# Altium schematic sheet TCAN1146_PINOUT.SchDoc
size B; SheetNumber: 2; SheetTotal: 5
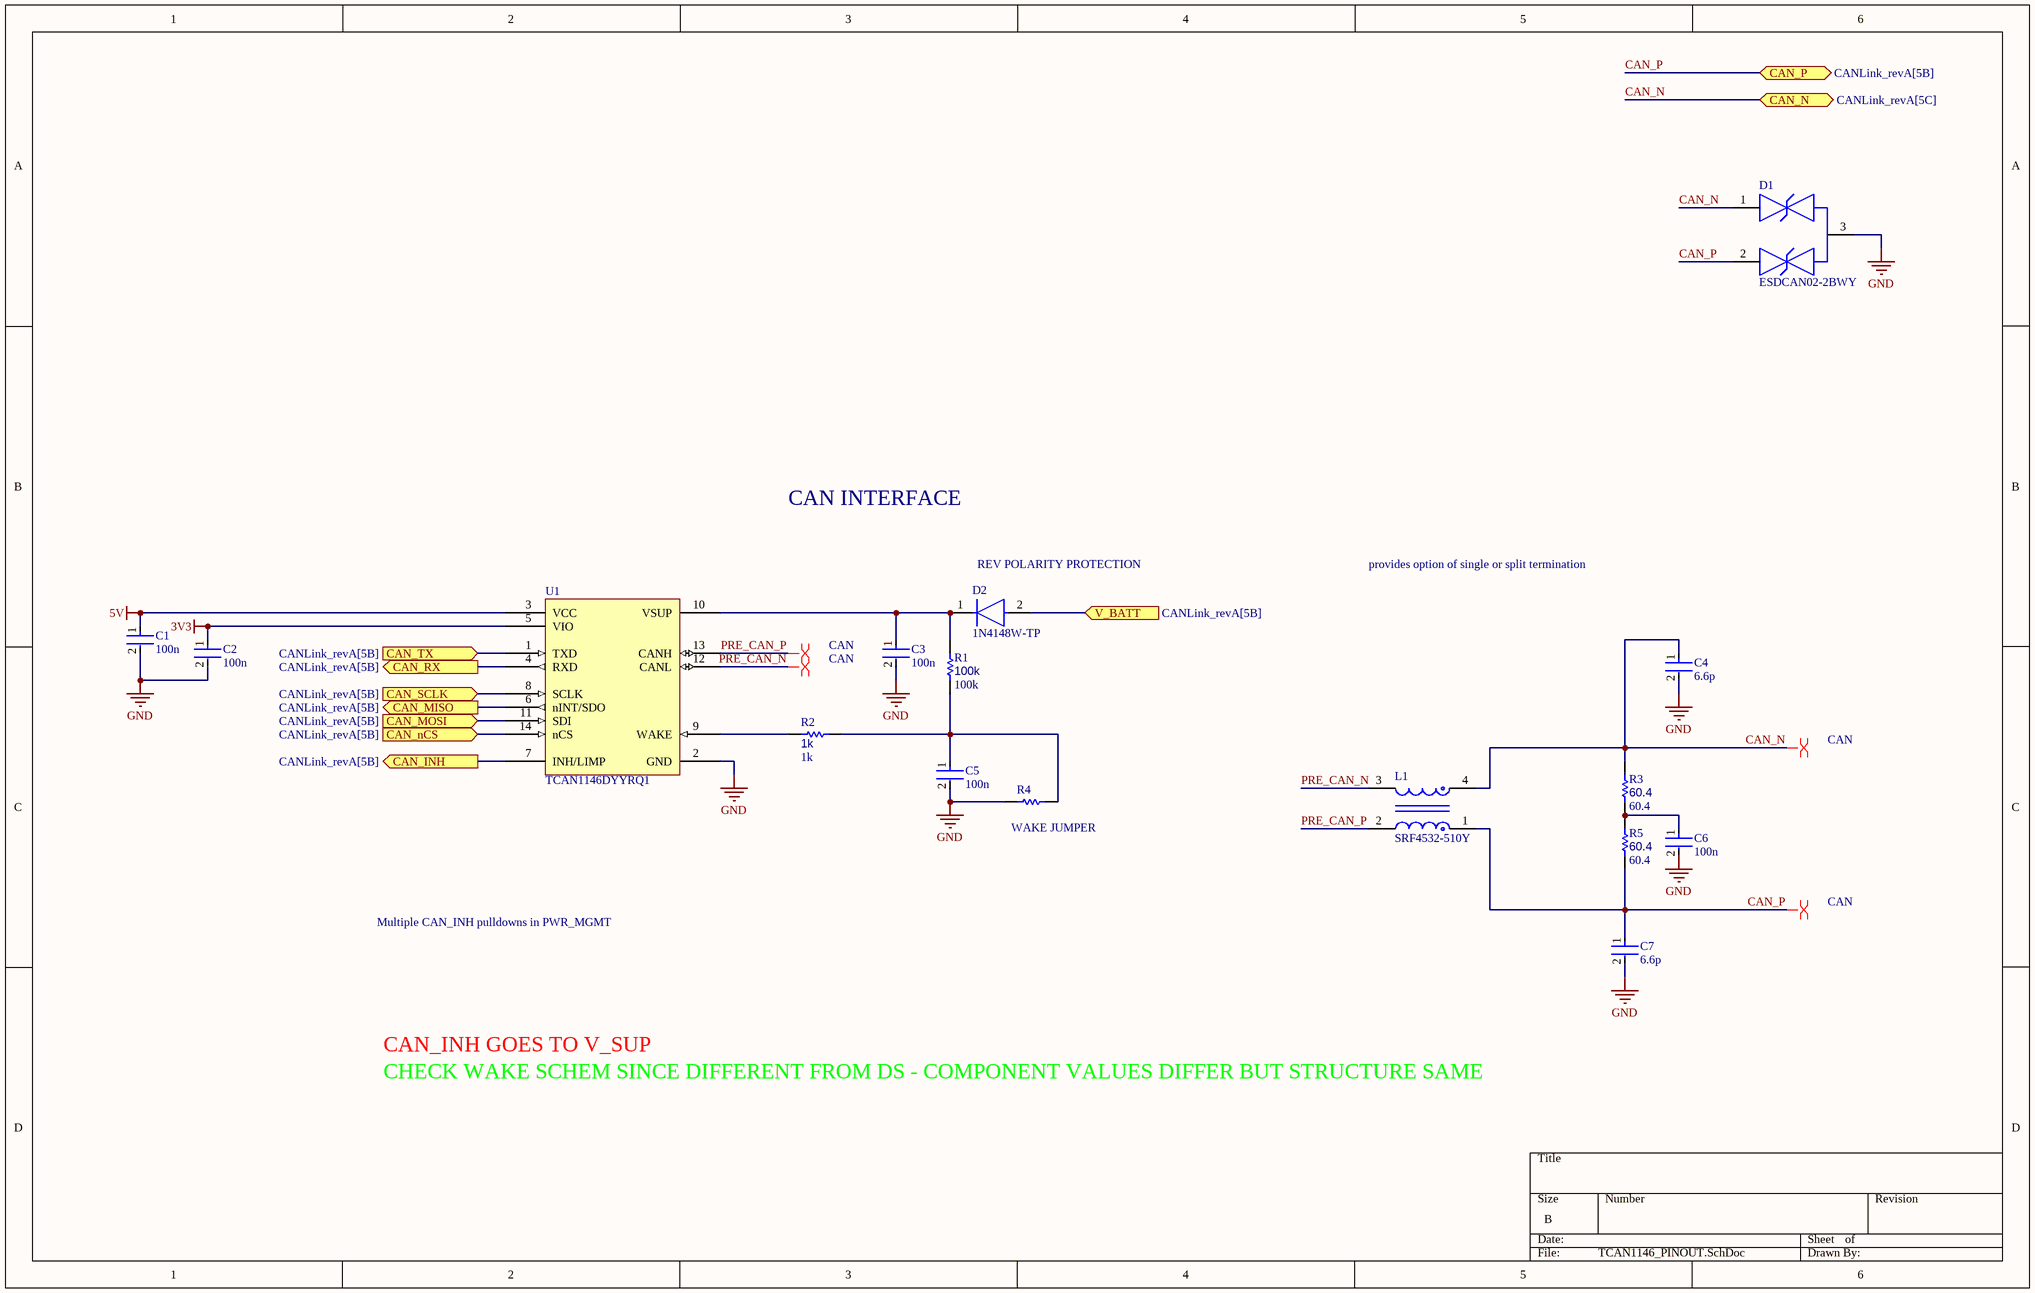
[diagram p0: TCAN1146_PINOUT.SchDoc]

## Parts
C1  100n  [FP-0402-L_1_0_0_05-W_0_5-IPC_A]
C2  100n  [FP-0402-L_1_0_0_05-W_0_5-IPC_A]
C3  100n  [FP-0402-L_1_0_0_05-W_0_5-IPC_A]
C4  6.6p  [FP-0402-L_1_0_0_05-W_0_5-IPC_A]
C5  100n  [FP-0402-L_1_0_0_05-W_0_5-IPC_A]
C6  100n  [FP-0402-L_1_0_0_05-W_0_5-IPC_A]
C7  6.6p  [FP-0402-L_1_0_0_05-W_0_5-IPC_A]
D1  ESDCAN02-2BWY  [FP-SOT323-3L-MFG]
D2  1N4148W-TP  [FP-SOD-123-IPC_A]
L1  SRF4532-510Y  [FP-SRF4532-MFG]
R1  100k  [R0603B]
R2  1k  [R0603B]
R3  60.4  [R0603B]
R4  0402 JUMPER  [RESC1005X40X25ML05T05]  (value not drawn)
R5  60.4  [R0603B]
U1  TCAN1146DYYRQ1  [TCAN1146DYYRQ1-Footprint-1]

## Ports
CAN_INH (out, see CANLink_revA[5B]), CAN_MISO (out, see CANLink_revA[5B]), CAN_MOSI (in, see CANLink_revA[5B]), CAN_N (bidir, see CANLink_revA[5C]), CAN_nCS (in, see CANLink_revA[5B]), CAN_P (bidir, see CANLink_revA[5B]), CAN_RX (out, see CANLink_revA[5B]), CAN_SCLK (in, see CANLink_revA[5B]), CAN_TX (in, see CANLink_revA[5B]), V_BATT (in, see CANLink_revA[5B])

## Nets
3V3: C2.1 U1.5(VIO)
5V: C1.1 U1.3(VCC)
GND: C1.2 C2.2 C3.2 C4.2 C5.2 C6.2 C7.2 D1.3 R4.1 U1.2(GND)
CAN_INH: U1.7(INH/LIMP) ; port CAN_INH
CAN_MISO: U1.6(nINT/SDO) ; port CAN_MISO
CAN_MOSI: U1.11(SDI) ; port CAN_MOSI
CAN_N: C4.1 D1.1 L1.4 R3.1 ; port CAN_N
CAN_nCS: U1.14(nCS) ; port CAN_nCS
CAN_P: C7.1 D1.2 L1.1 R5.2 ; port CAN_P
CAN_RX: U1.4(RXD) ; port CAN_RX
CAN_SCLK: U1.8(SCLK) ; port CAN_SCLK
CAN_TX: U1.1(TXD) ; port CAN_TX
PRE_CAN_N: L1.3 U1.12(CANL)
PRE_CAN_P: L1.2 U1.13(CANH)
V_BATT: D2.2(A) ; port V_BATT
NetC3_1: C3.1 D2.1(C) R1.1 U1.10(VSUP)
NetC5_1: C5.1 R1.2 R2.2 R4.2
NetC6_1: C6.1 R3.2 R5.1
NetR2_1: R2.1 U1.9(WAKE)

## Layout directives
differential pair; differential pair class CAN: CAN_N, CAN_P, PRE_CAN_N, PRE_CAN_P

## Notes on the sheet
- CAN INTERFACE
- (near D2) REV POLARITY PROTECTION
- provides option of single or split termination
- (near R4) WAKE JUMPER
- Multiple CAN_INH pulldowns in PWR_MGMT
- CHECK WAKE SCHEM SINCE DIFFERENT FROM DS - COMPONENT VALUES DIFFER BUT STRUCTURE SAME
- CAN_INH GOES TO V_SUP

## Library data of the parts
C1-C7 = CMP-001-00058-1: LARGE PADS, 0402 CAP, CHANGE COMMENT TO MATCH REAL P/N; Capacitor Type: Ceramic; Min Operating Temperature: -55°C; Mounting Technology: Surface Mount; Pins: 2; Case/Package: 0402; RoHS Compliant: Yes; Max Operating Temperature: 85°C
  C1-C3 C5 C6: Value: 100n
  C4 C7: Value: 6.6p
D1 = CMP-12225-000055-1: TVS DIODE 26.5V 44V SOT323-3; Manufacturer: STMicroelectronics; Value: 3pF; Direction: Bidirectional; Breakdown Voltage: 28.5V; Automotive Grade: Grade 0; Standoff Height: 0mm; Peak Pulse Power: 170W; Peak Pulse Current: 3A; Number Of Channels: 2; Max Junction Temp: +175°C; Mouser Description: TVS Diodes / ESD Suppressors Automotive dual-line Transil, Transient voltage suppressor (TVS) for CAN bus; Height: 1.1mm; Category: Diode; Reverse Standoff Voltage: 26.5V; Device Class L1: Circuit Protection; Temperature: -55°C to +175°C; RoHS: TRUE; ComponentLink2URL: https://www.st.com/resource/en/datasheet/esdcan02-2bwy.pdf; Device Class L3: unset; Device Class L2: TVS Diodes; Temperature Range High: +175°C; Octopart: https://octopart.com/esdcan02-2bwy-stmicroelectronics-58631133; Ipc Land Pattern Name: SOT65P210X95-3; Temperature Range Low: -55°C; Capacitance: 3pF; Digikey Description: TVS DIODE 26.5V 44V SOT323-3; Automotive: Yes; ComponentLink2Description: Datasheet; Clamping Voltage: 44V; Manufacturer Part Number: ESDCAN02-2BWY; Lead Free: Yes; Package: SOT323-3L
D2 = CMP-2000-04993-2: DIODE GEN PURP 100V 150MA SOD123; Max Reverse Leakage Current: 5uA; Max Surge Current: 2A; Reverse Recovery Time: 4ns; Polarity: Standard; Capacitance: 4pF; Max Forward Surge Current (Ifsm): 1A; Element Configuration: Single; Power Dissipation: 400mW; Forward Voltage: 1V; Radiation Hardening: No; Lead Free: Lead Free; Max Reverse Voltage (DC): 100V; Current Rating: 150mA; Forward Current: 150mA; Packaging: Tape and Reel; Number of Pins: 2; Package Quantity: 3000; Max Operating Temperature: 150°C; Min Operating Temperature: -65°C; Average Rectified Current: 150mA; Recovery Time: 4ns; Output Current: 150mA; Peak Non-Repetitive Surge Current: 2A; Width: 1.8mm; Voltage Rating (DC): 100V; Height: 1.2mm; Max Repetitive Reverse Voltage (Vrrm): 100V; Mount: Surface Mount; Length: 2.85mm
L1 = CMP-07251-000006-1: CMC 51UH 200MA 2LN 2KOHM SMD; Element Configuration: Dual; Number of Lines: 2; Core Material: Ferrite; Impedance: 2kR; Test Frequency: 100kHz; Voltage Rating (DC): 50V; Insulation Resistance: 10MR; Material: Steel; Tolerance: 50%; DC Resistance (DCR): 3.5R; RoHS Compliant: Yes; Mount: Surface Mount; REACH SVHC: No SVHC; Termination: SMD/SMT; DC Current: 200mA; Current: 200mA; Lead Free: Lead Free; Contact Plating: Tin; Length: 4.5mm; Max DC Current: 200mA; Width: 0.126inch; Case/Package: 4532; Packaging: Tape and Reel; Package Quantity: 1; Min Operating Temperature: -40°C; Depth: 3.4mm; Series: SRF4532; Max Operating Temperature: 125°C; Current Rating: 200mA; Self Resonant Frequency: 100kHz; Height: 0.118inch; Inductance: 51uH; Resistance: 2kR
R1-R3 R5 = CMP-009-00002-14: Resistor
  R1: Value: 100k
  R2: Value: 1k
  R3 R5: Value: 60.4
R4 = CMP-009-00118-2: READ THE NAME; Pins: 2; Component Type: Standard; Design Item ID: CMP-009-00206-2; Source: 0402jump.SchLib
U1 = CMP-318-000000-2: Automotive CAN FD transceiver with watchdog, bus diagnostics and partial networking via sele 14-SOT-23-THIN -40 to 150; Component Type: Standard; Design Item ID: CMP-015-00012-2; Pin Count: 14; Source: TCAN1146DYYRQ1.SchLib